# EAGLE design rev18 (EAGLE 7.5.0)
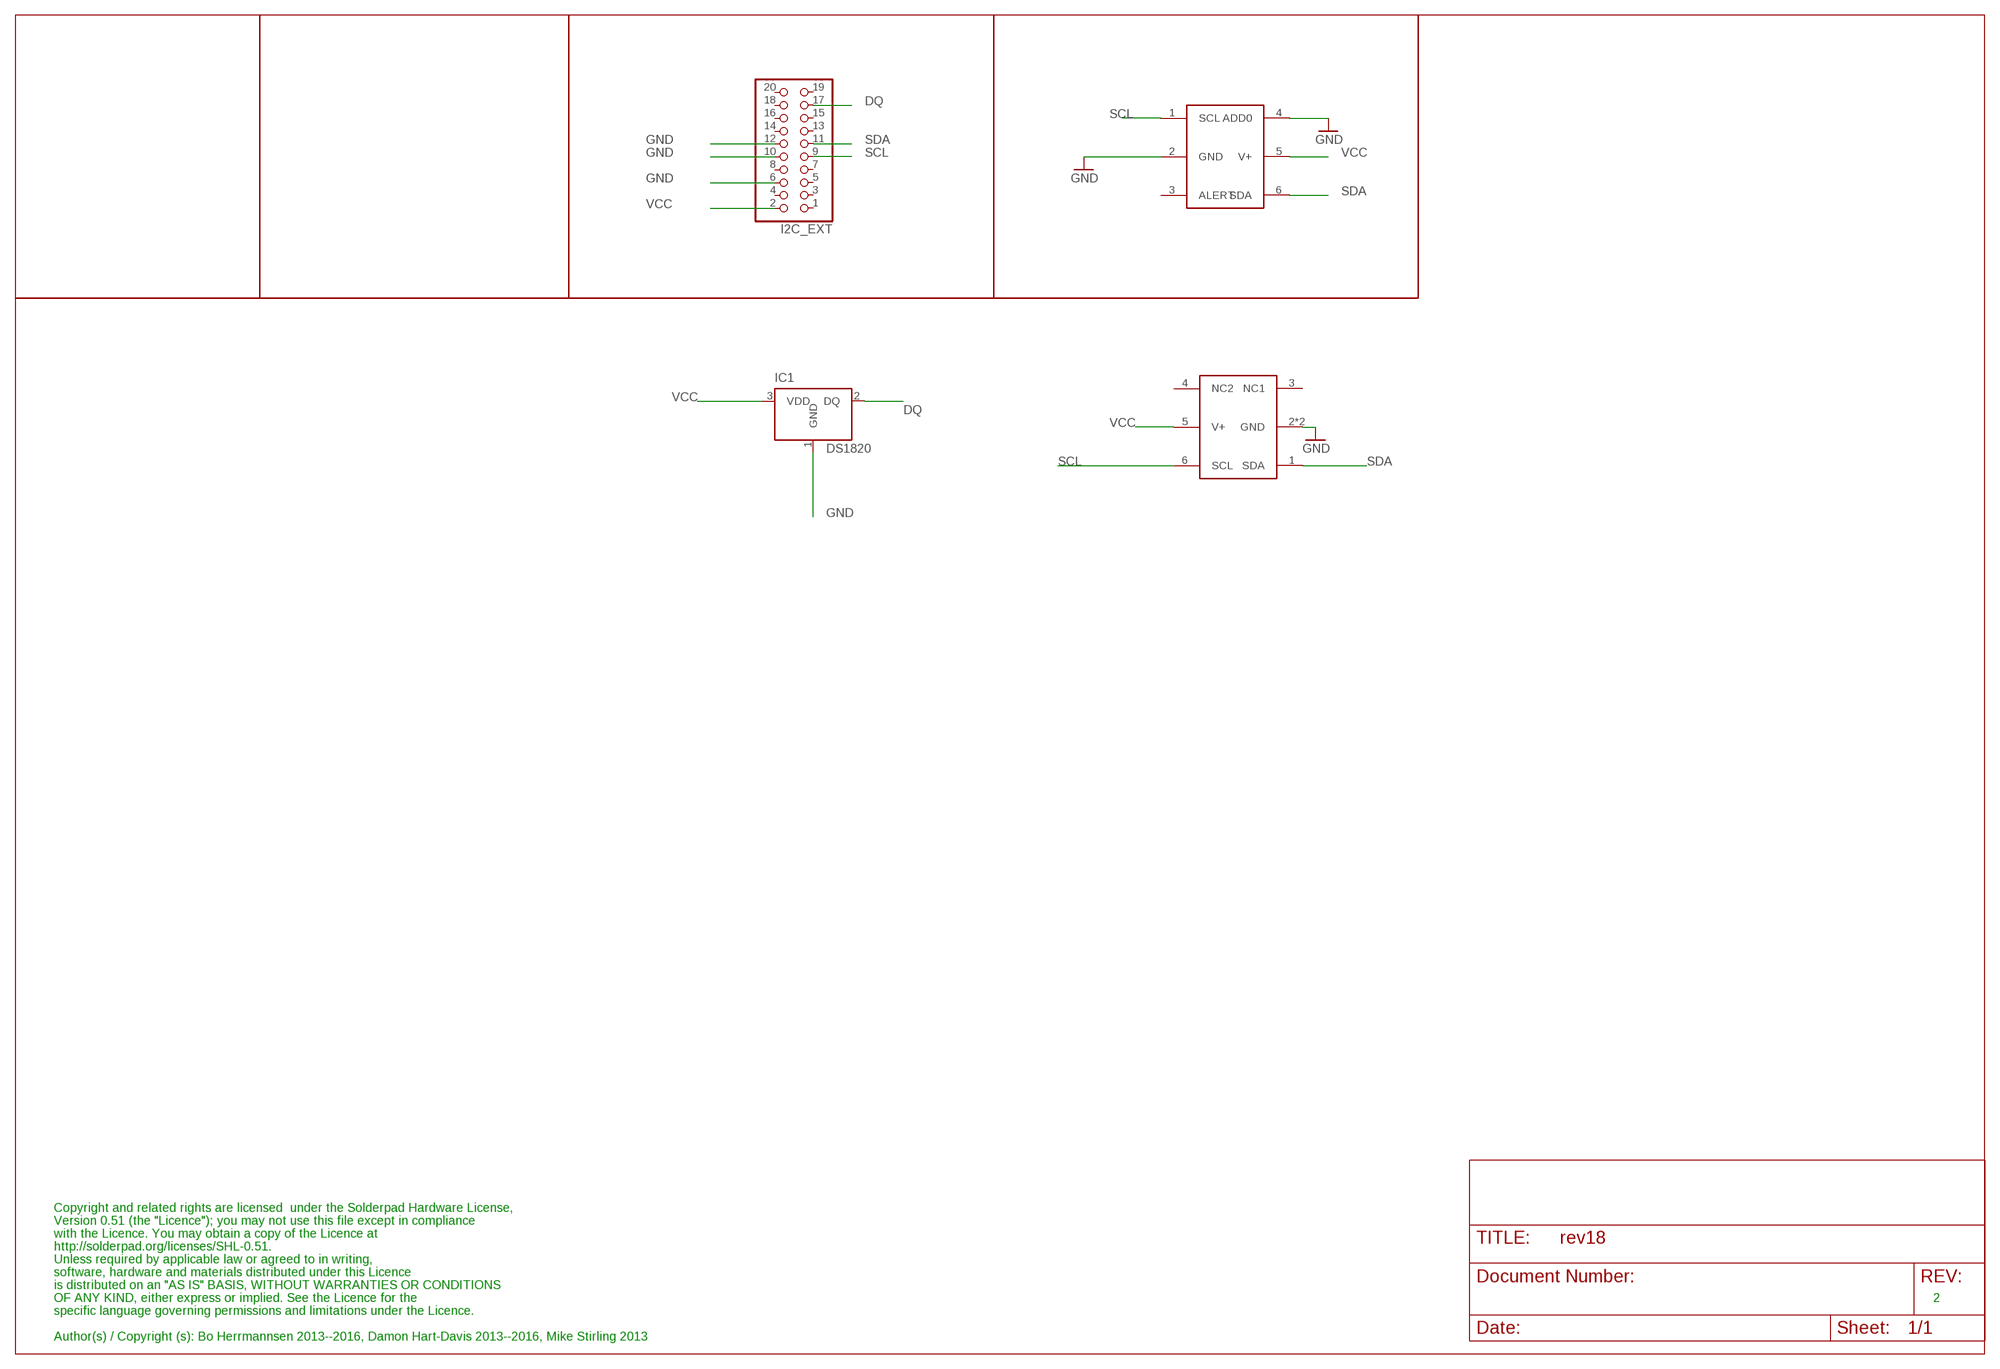
[diagram p0: schematic, sheet 1]

## Parts
I2C_EXT  PINHD-2X10  [2X10]
IC1  DS1820  [TO-92]
TMP112  TMP1  TMP112  [TMP112]
U$4  SHT21  [SHT21]

## Nets
DQ: I2C_EXT.17 IC1.2(DQ)
GND [supply]: I2C_EXT.6 I2C_EXT.10 I2C_EXT.12 IC1.1(GND) TMP112.2(GND) TMP112.4(ADD0) U$4.2(GND) U$4.P$1(GND)
SCL: I2C_EXT.9 TMP112.1(SCL) U$4.6(SCL)
SDA: I2C_EXT.11 TMP112.6(SDA) U$4.1(SDA)
VCC [supply]: I2C_EXT.2 IC1.3(VDD) TMP112.5(V+) U$4.5(V+)
Unconnected: I2C_EXT.1 I2C_EXT.3 I2C_EXT.4 I2C_EXT.5 I2C_EXT.7 I2C_EXT.8 I2C_EXT.13 I2C_EXT.14 I2C_EXT.15 I2C_EXT.16 I2C_EXT.18 I2C_EXT.19 I2C_EXT.20 TMP112.3(ALERT) U$4.3(NC1) U$4.4(NC2)

## Notes on the sheet
- Copyright and related rights are licensed  under the Solderpad Hardware License,
- Version 0.51 (the "Licence"); you may not use this file except in compliance
- with the Licence. You may obtain a copy of the Licence at
- http://solderpad.org/licenses/SHL-0.51.
- Unless required by applicable law or agreed to in writing,
- software, hardware and materials distributed under this Licence
- is distributed on an "AS IS" BASIS, WITHOUT WARRANTIES OR CONDITIONS
- OF ANY KIND, either express or implied. See the Licence for the | 2
- specific language governing permissions and limitations under the Licence.
- Author(s) / Copyright (s): Bo Herrmannsen 2013--2016, Damon Hart-Davis 2013--2016, Mike Stirling 2013

## Library data of the parts
I2C_EXT = pinhead:PINHD-2X10: PIN HEADER
IC1 = DS1820:DS1820: DS1820 - 1-Wire Digital Thermometer
TMP112 = TMP112_2:TMP112
U$4 = SHT21:SHT21: Tempsensor RS No: 709-8868 MRF No: TMP112AIDRLT

## Net classes
0 default: width 0.203 mm
1 supply: width 0.406 mm, clearance 0.203 mm
2 ant: width 2.184 mm

## Board
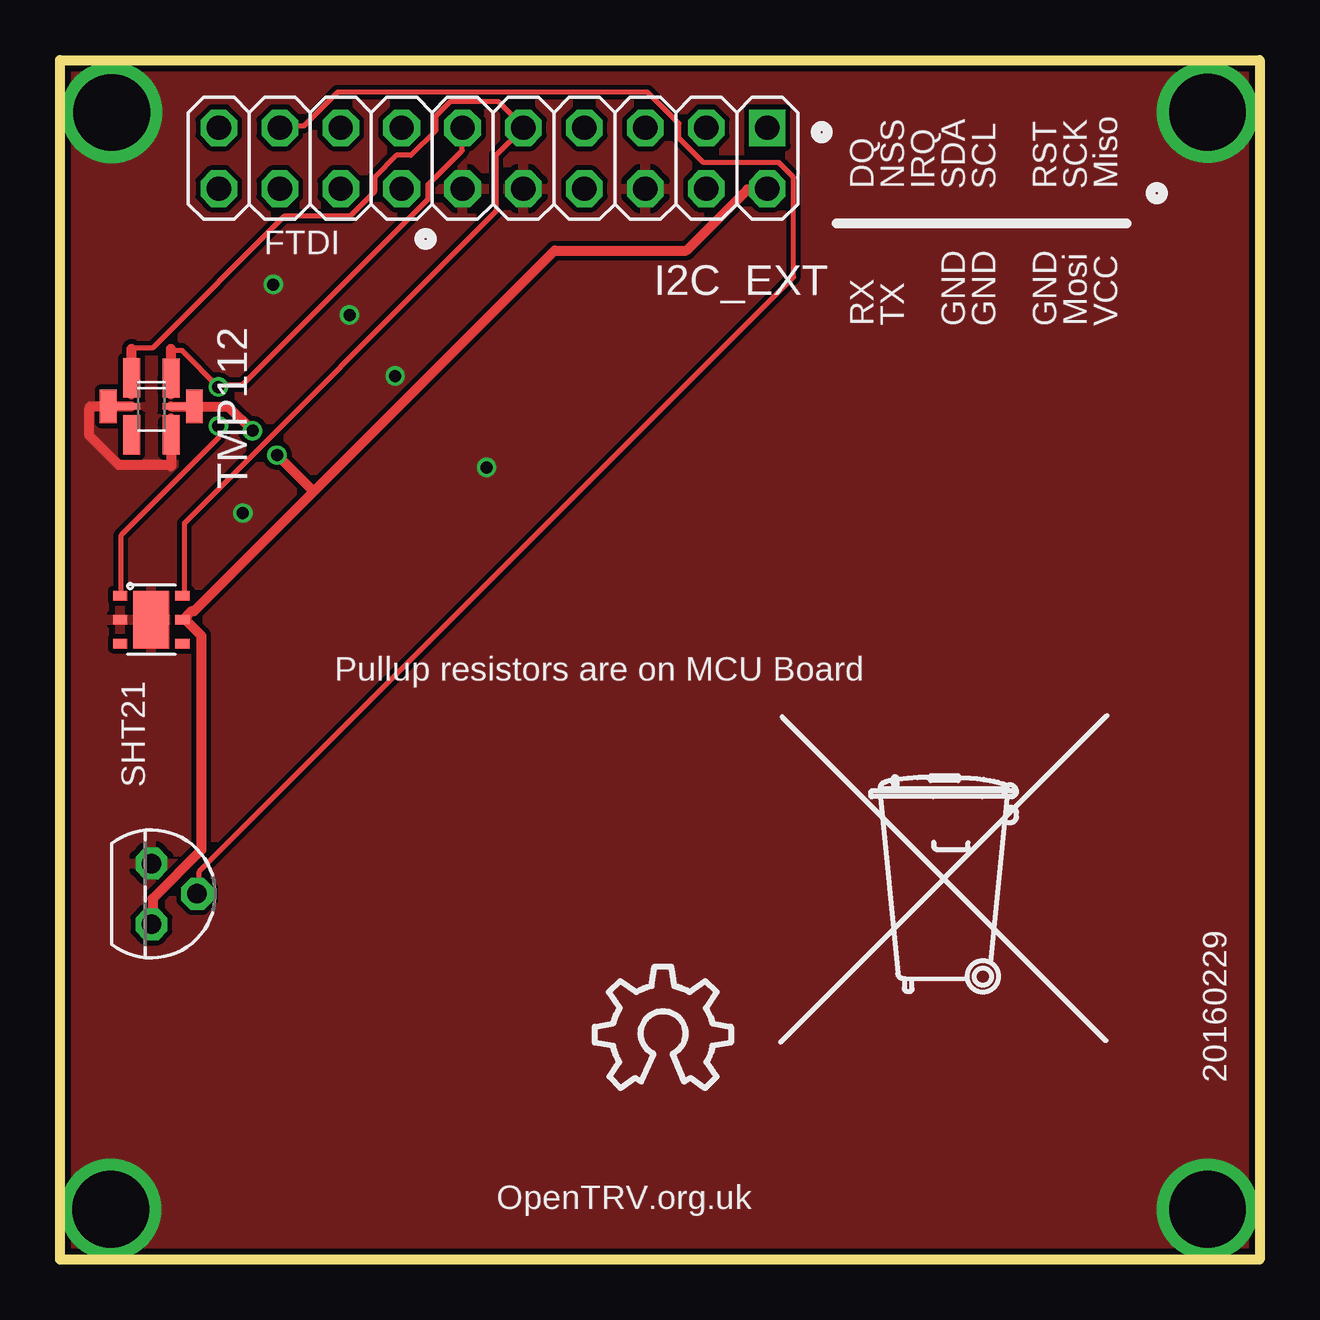
[diagram p1: board, top side]
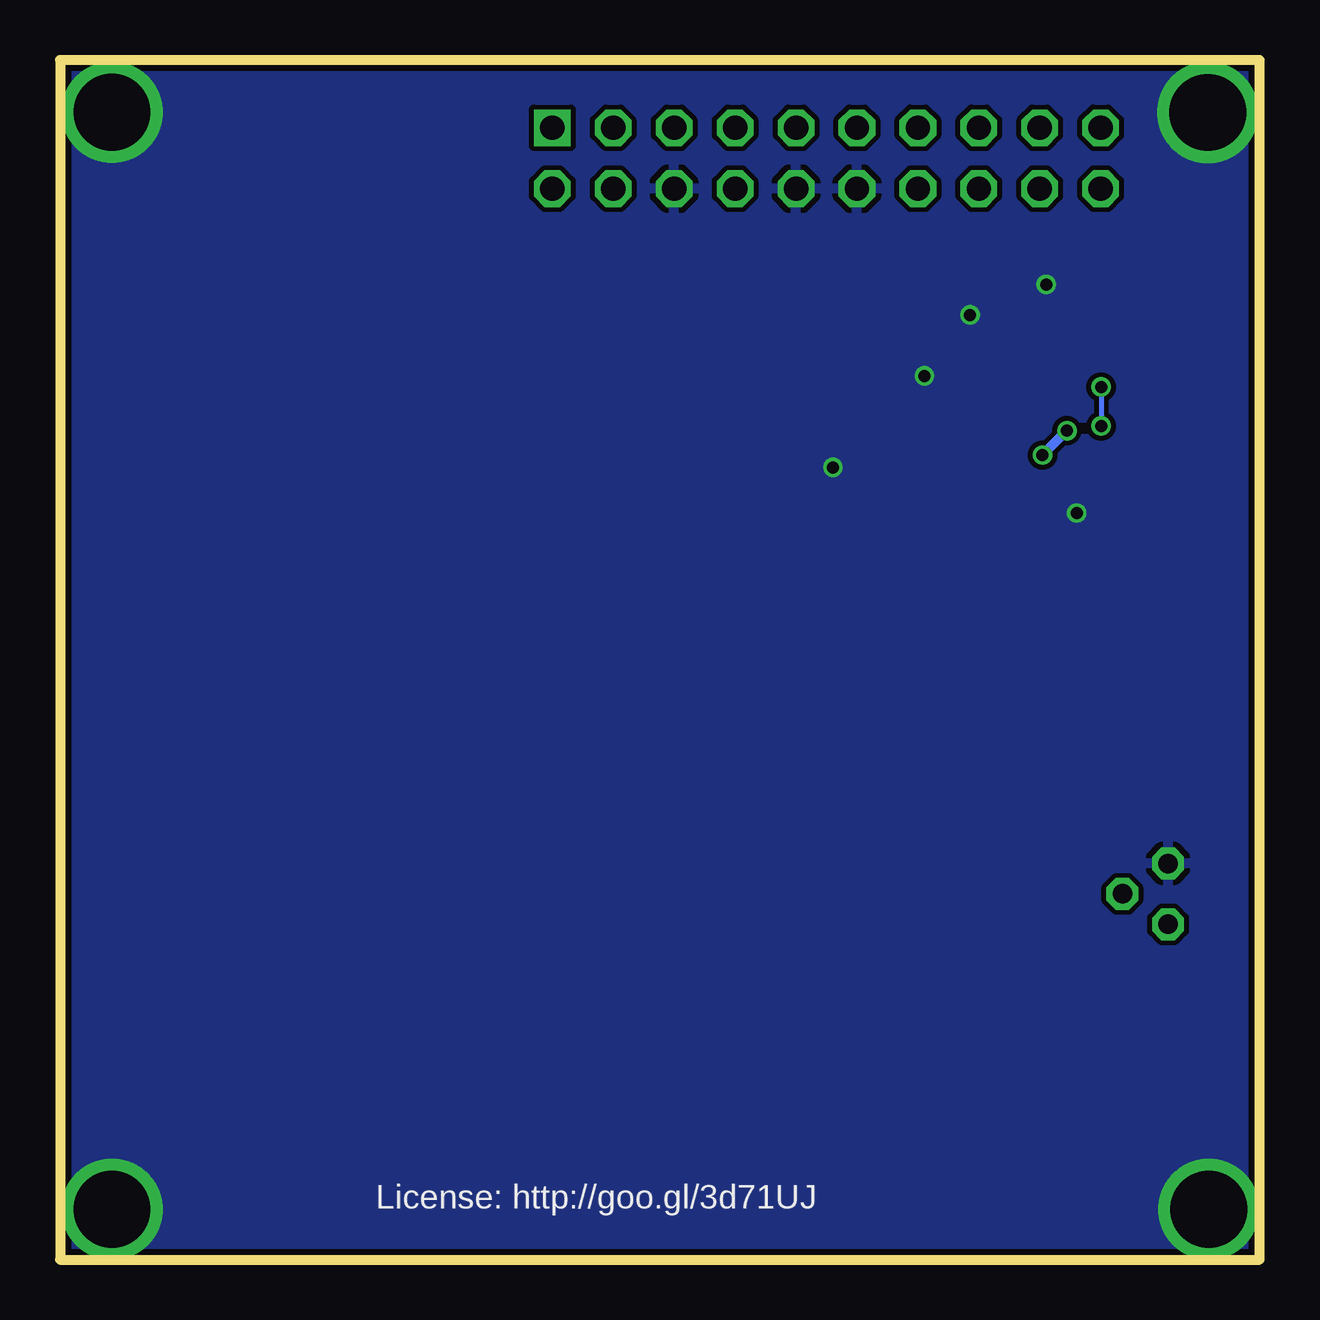
[diagram p2: board, bottom side, seen from below]

Size 50 x 50 mm. Coordinates in mm from the lower left corner, seen from the top.
Outline: 0,0 0,50 50,50 50,0 0,0
Copper layers (1*16): Top 0.035mm / dielectric 1.5mm / Bottom 0.035mm
Design rules "PMServicesStd *": minimum track width 8mil, minimum drill 0.5mm, track to track 8mil, track to pad 8mil, pad to pad 8mil, via to via 8mil, smd to smd 0mil, copper to edge 10mil, drill to drill 10mil, minimum pad ring 10mil, minimum via ring 6mil, stop-mask expansion 2mil, vias tented up to drill 100mil, thermal gap 10mil

### Footprints (pad centres in the part's own frame; a part is rotated, then mirrored left to right if it is on the bottom)
2X10 = drill 1.016 square: 1 -11.43,-1.27 | drill 1.016 octagon: 2 -11.43,1.27; 3 -8.89,-1.27; 4 -8.89,1.27; 5 -6.35,-1.27; 6 -6.35,1.27; 7 -3.81,-1.27; 8 -3.81,1.27; 9 -1.27,-1.27; 10 -1.27,1.27; 11 1.27,-1.27; 12 1.27,1.27; 13 3.81,-1.27; 14 3.81,1.27; 15 6.35,-1.27; 16 6.35,1.27; 17 8.89,-1.27; 18 8.89,1.27; 19 11.43,-1.27; 20 11.43,1.27
TO-92 = drill 0.813 pad 1.27 octagon: 1 -1.27,0; 2 0,1.905; 3 1.27,0
TMP112 = smd 0.285 x 0.7: 1 -0.5,-0.825; 2 0,-0.825; 3 0.5,-0.825; 4 0.5,0.825; 5 0,0.825; 6 -0.5,0.825; 7 0.777,-0.825; 8 1.325,-0.825; 9 1.05,-0.825; 10 1.868,-0.826; 11 1.595,-0.826; 12 -1.863,-0.825; 13 -1.314,-0.825; 14 -1.59,-0.825; 15 -0.772,-0.825; 16 -1.044,-0.825; 17 -1.86,0.822; 18 -1.312,0.822; 19 -1.587,0.822; 20 -0.769,0.821; 21 -1.041,0.821; 22 0.766,0.824; 23 1.315,0.824; 24 1.039,0.824; 25 1.857,0.823; 26 1.585,0.823; 27 -0.548,1.797; 28 0,1.797; 29 -0.275,1.797; 30 0.543,1.797; 31 0.271,1.797; 32 0.001,1.383; 33 -0.548,-1.798; 34 0,-1.798; 35 -0.275,-1.798; 36 0.543,-1.799; 37 0.271,-1.799; 38 0,-1.322
SHT21 = smd 0.4 x 0.6: 1 -1,-1.3; 2 0,-1.3; 3 1,-1.3; 4 1,1.3; 5 0,1.3; 6 -1,1.3 | smd 2.4 x 1.5: P$1 0,0

### Placement (x,y rotation side)
I2C_EXT  18.05,45.91 180 top
IC1  3.81,15.24 270 top
TMP112  3.81,35.56 270 top
U$1  [OSHW_10X200_NOTEXT]  22.29,7.14 0 top
U$2  [TONNE]  36.7,13.12 0 top
U$4  3.81,26.67 270 top

### Tracks (layer width: path | path; a pad name or v marks a point on that pad's centre or on a via)
DQ
  Top 0.203: IC1.2 5.79,15.24 5.79,16.15 30.58,40.95 30.58,45.11 29.97,45.72 26.82,45.72 25.81,46.74 25.81,47.35 24.49,48.67 11.58,48.67 10.16,47.24 9.25,47.24 I2C_EXT.17
GND  (via drill 0.5, 3.2)
  Top 0.406: TMP112.4 4.63,33.12 | 4.63,33.12 4.63,33.06 | TMP112.2 1.27,35.56 1.22,35.46 1.22,34.34 2.44,33.12 4.63,33.12
  other vias: 2.16,47.81 47.83,47.82 47.83,2.1 2.11,2.1 8.89,40.64 12.06,39.37 13.97,36.83 7.62,31.11 17.78,33.02
  pour Bottom: 0,50 0,0 50,0 50,50
  pour Top: 0,50 0,0 50,0 50,50
SCL
  Top 0.203: U$4.6 5.18,27.74 5.18,30.68 18.19,43.69 18.19,46.02 19.3,47.14 I2C_EXT.9 19.3,47.24 18.29,48.26 16.26,48.26 15.65,47.65 15.65,47.04 14.63,46.02 14.02,46.02 13.11,45.11 13.11,44.5 12.09,43.48 9.35,43.48 3.86,38 3.15,38 2.98,37.97
  Top 0.406: TMP112.1 2.98,37.97
SDA  (via drill 0.5)
  Top 0.203: v6.6,34.75 6.6,34.24 2.54,30.18 2.54,27.74 U$4.1 | 4.63,37.9 5.08,37.9 v6.6,36.37 6.6,36.47 7.62,36.47 15.34,44.2 15.34,44.81 16.76,46.23 16.76,47.14 I2C_EXT.11
  Top 0.406: TMP112.6 4.63,37.9 4.63,37.97
  Bottom 0.203: v6.6,36.37 v6.6,34.75
VCC  (via drill 0.5)
  Top 0.406: TMP112.5 7.01,35.56 v8.03,34.54 | 10.57,32 20.62,42.06 26.11,42.06 28.65,44.6 29.46,44.6 I2C_EXT.2 | 10.57,32 5.59,27.03 5.49,27.03 5.18,26.72 U$4.5 5.28,26.62 5.89,26.01 5.89,17.07 3.86,15.04 3.86,14.02 IC1.3 | 10.57,32 v9.04,33.53
  Bottom 0.406: v9.04,33.53 v8.03,34.54

### Text on the board
bPlace: License: http://goo.gl/3d71UJ
tNames: DQ | NSS | IRQ | SDA | SCL | RST | SCK | Miso | FTDI | RX | TX | GND | GND | GND | Mosi | VCC | SHT21 | Pullup resistors are on MCU Board | 20160229 | OpenTRV.org.uk